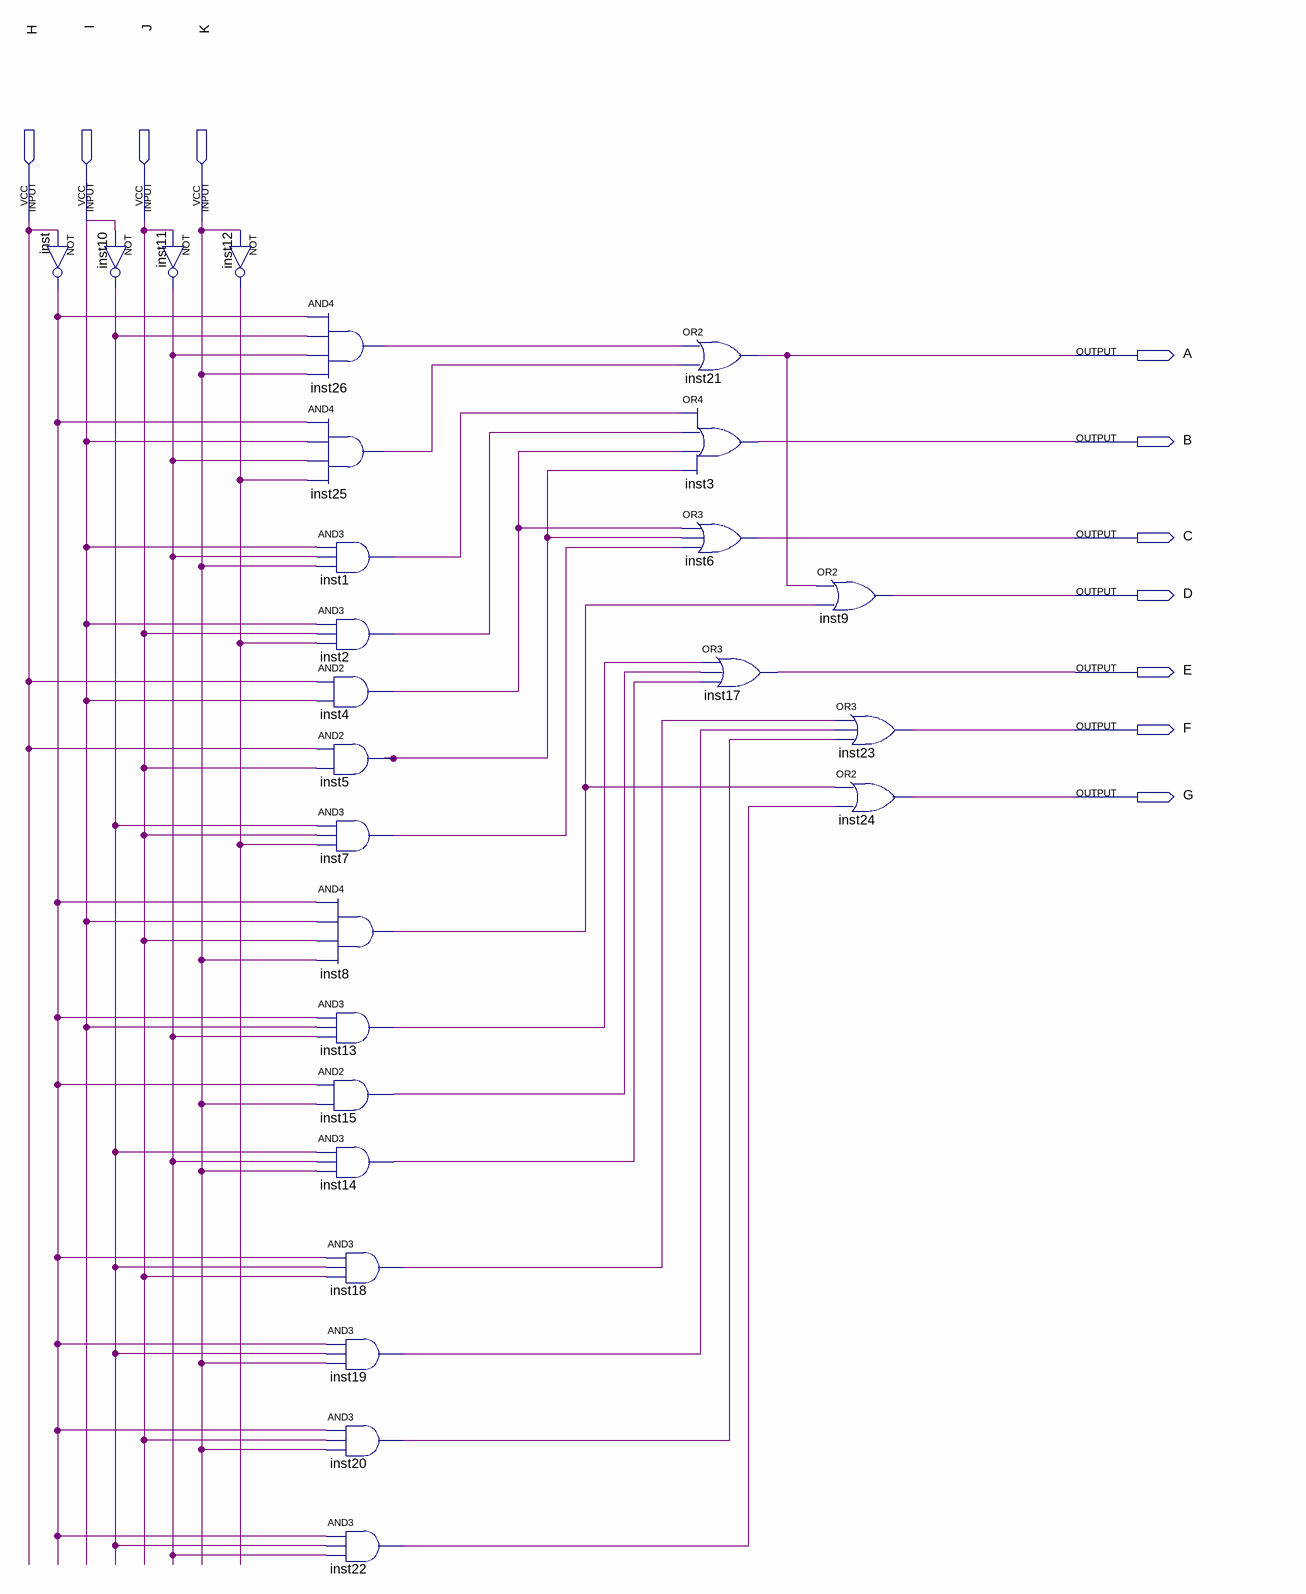
[diagram p0: schematic sheet]
// Quartus schematic seven_segment.bdf as structural Verilog: 26 symbols, 11 pins
module seven_segment (
  input  H,
  input  I,
  input  J,
  input  K,
  output A,
  output B,
  output C,
  output D,
  output E,
  output F,
  output G
);

  wire inst1_out, inst2_out, inst4_out, inst5_out, inst7_out, inst8_out, inst10_out, inst11_out, inst12_out,
       inst13_out, inst14_out, inst15_out, inst18_out, inst19_out, inst20_out, inst22_out, inst25_out,
       inst26_out, inst_out;

  not inst (inst_out, H);
  not inst10 (inst10_out, I);
  not inst11 (inst11_out, J);
  not inst12 (inst12_out, K);
  and inst26 (inst26_out, inst_out, inst10_out, inst11_out, K);
  and inst25 (inst25_out, inst_out, I, inst11_out, inst12_out);
  and inst1 (inst1_out, I, inst11_out, K);
  and inst2 (inst2_out, I, J, inst12_out);
  and inst4 (inst4_out, H, I);
  and inst5 (inst5_out, H, J);
  and inst7 (inst7_out, inst10_out, J, inst12_out);
  and inst8 (inst8_out, inst_out, I, J, K);
  and inst13 (inst13_out, inst_out, I, inst11_out);
  and inst15 (inst15_out, inst_out, K);
  and inst14 (inst14_out, inst10_out, inst11_out, K);
  and inst18 (inst18_out, inst_out, inst10_out, J);
  and inst19 (inst19_out, inst_out, inst10_out, K);
  and inst20 (inst20_out, inst_out, J, K);
  and inst22 (inst22_out, inst_out, inst10_out, inst11_out);
  or inst21 (A, inst26_out, inst25_out);
  or inst3 (B, inst1_out, inst2_out, inst4_out, inst5_out);
  or inst6 (C, inst4_out, inst5_out, inst7_out);
  or inst17 (E, inst13_out, inst15_out, inst14_out);
  or inst9 (D, A, inst8_out);
  or inst23 (F, inst18_out, inst19_out, inst20_out);
  or inst24 (G, inst8_out, inst22_out);
endmodule
